# Altium project ESE516_TeamC&K_Project_.PrjPcb (part 2 of 2)

## Sheet sensor.SchDoc: Sensor
size 431 x 279 mm; Author: Changran Liu / Kaiwen Zhou; CompanyName: Upenn; DrawnBy: Changran Liu / Kaiwen Zhou; Engineer: Changran Liu / Kaiwen Zhou; Organization: Upenn; DocumentNumber: 9; SheetNumber: 8; SheetTotal: 9
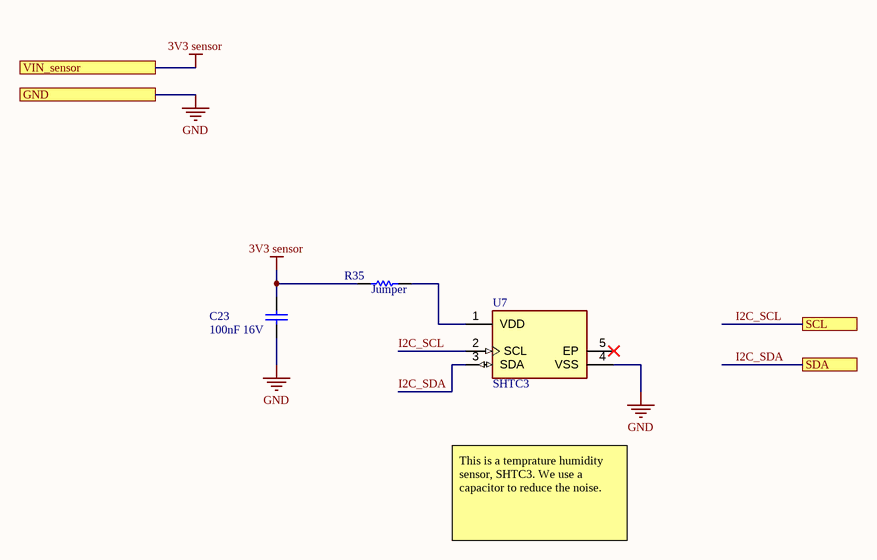
[diagram p7: sensor.SchDoc]

### Parts
C23  100nF 16V  [CAPC0603(1608)100_N]
R35  Jumper  [RESC0603(1608)_N]
U7  SHTC3  [FP-SHTC3-IPC_A]

### Ports
GND, SCL, SDA, VIN_sensor

### Nets
3V3 sensor: C23.2 R35.1 ; port VIN_sensor  [project net 3V3]
GND: C23.1 U7.4(VSS) ; port GND
I2C_SCL: U7.2(SCL) ; port SCL
I2C_SDA: U7.3(SDA) ; port SDA
NetR35_2: R35.2 U7.1(VDD)

Not connected (* = marked no-connect by the designer): U7 5(EP)*

### Notes on the sheet
- This is a temprature humidity sensor, SHTC3. We use a capacitor to reduce the noise.
- DWG. NO.
- REV.
- SHT.
- THIS DOCUMENT AND THE DATA DISCLOSED HEREIN OR HEREWITH IS THE PROPERTY OF ALTIUM LIMITED AND MAY BE FREELY DISTRIBUTED IN WHOLE. NO RIGHTS ARE RESERVED OR EXPRESS OR IMPLIED WARANTEE GIVEN.
- REVISION
- DESCRIPTION
- DATE
- APPROVED
- ENG:
- APPROVALS
- PROJECT
- DSN:
- CHK:
- REFERENCE DOCUMENTS
- PROJECT REVISION:
- TITLE
- DOCUMENT REVISION:
- DESIGN ITEM:
- BOM:
- FAB DWG:
- PCB DWG:
- ASSY DWG:
- SCALE:
- SIZE
- B
- CAGE CODE
- FILE NAME
- DWG NO.
- SHEET
- OF
- REV

### Library data of the parts
C23 = CMP-1035-02584-1: CAP 100nF 16V ±10% 0603 (1608 Metric) Thickness 1mm SMD; Tolerance: Â±10%; Case-EIA: 0603; Case-Metric: 1608; Technology: SMT; Max Thickness: 1 mm; Value: 100nF; Rated Voltage: 16 V
R35 = CMP-1012-00001-1: Jumper 0603 (1608 Metric); Case-Metric: 1608; Value: 0.00 Ohm; Power: None; Case-EIA: 0603; Technology: SMT; Tolerance: None
U7 = CMP-144040-000003-1: SENSOR HUMI/TEMP I2C 2% SMD; Manufacturer: Sensirion; Operating Supply Current: 0.3-900uA; Resolution: 16bits; Min Supply Voltage: 1.62V; Max Supply Voltage: 3.6V; Category: IC; Device Class L3: unset; ComponentLink2URL: https://www.sensirion.com/fileadmin/user_upload/customers/sensirion/Dokumente/0_Datasheets/Humidity/Sensirion_Humidity_Sensors_SHTC3_Datasheet.pdf; Ipc Land Pattern Name: DFN200X200X75-4; RoHS: TRUE; Height: 0.75mm; Interface: I2C; Temperature Range High: +125°C; Accuracy: 2%; Sensor Output: I2C; Automotive: No; Package: 0; Device Class L1: Sensors; Manufacturer Part Number: SHTC3; Digikey Description: SENSOR HUMI/TEMP I2C 2% SMD; Lead Free: Yes; Temperature: -40°C to +125°C; Device Class L2: Temperature and Humidity Sensors; ComponentLink2Description: Datasheet; Octopart: https://octopart.com/shtc3-sensirion-91912225; Mouser Description: SHTC3 Series 0 to 100% RH 3.6 V Humidity and Temperature Sensor IC - DFN-4; Temperature Range Low: -40°C

## Nets that join several sheets
3V3: MAIN (9 pins), MCU (7 pins), Memory (5 pins), Thumbstick (U6.3 U6.6), sensor (C23.2 R35.1)
5V: MAIN (J1.2 R6.1), Audio (C20.2 U5.6)
GND: MAIN (17 pins), FTDI (10 pins), MCU (22 pins), Memory (5 pins), 3.3V_BuckDesign (C16.1 C17.1 R27.1 U4.4), Audio (6 pins), Thumbstick (R32.1 R34.1 U6.1 U6.4), sensor (C23.1 U7.4)
VBUS: MAIN (J2.1), FTDI (C2.2 D2.4 FB1.1)
VIN: MAIN (R6.2), 3.3V_BuckDesign (R23.1)
VUSB: MAIN (TP1.1), FTDI (6 pins)
Audio V_~{SD}: MAIN (R38.2), MCU (U3.36), Audio (U5.1)
FLASH_MEM_SPI_SS: MCU (U3.37), Memory (R19.1 SD1.2 TP21.1)
I2C_SCL: MAIN (6 pins), MCU (U3.39), sensor (U7.2)
I2C_SDA: MAIN (6 pins), MCU (U3.38), sensor (U7.3)
JOYSTICK_X: MAIN (TP9.1), MCU (U3.27), Thumbstick (R31.1 R32.2)
JOYSTICK_Y: MAIN (TP10.1), MCU (U3.28), Thumbstick (R33.1 R34.2)
MCU_LED: MAIN (DS1.2), MCU (U3.16)
MCU_RX_UART_CLI: MAIN (TP4.1), FTDI (U1.7), MCU (U3.44)
MCU_TX_UART_CLI: MAIN (TP2.1), FTDI (U1.10), MCU (U3.43)
MEM_SPI_CLK: MAIN (R13.2), Memory (SD1.5 TP20.1)
MEM_SPI_MISO: MAIN (R12.2), Memory (SD1.7 TP19.1)
MEM_SPI_MOSI: MAIN (R11.2), Memory (SD1.3 TP18.1)
SERCOM1_PAD2_SPI_MISO: MAIN (R12.1), MCU (U3.8)
SERCOM1_PAD2_SPI_MOSI: MAIN (R11.1), MCU (U3.11)
SERCOM1_PAD3_SPI_SCK: MAIN (R13.1), MCU (U3.12)
SPEAKER_OUT: MAIN (TP8.1), MCU (U3.31), Audio (R30.1)
USB_DATA_N: MAIN (J2.2), FTDI (C5.2 D2.3 R1.1)
USB_DATA_P: MAIN (J2.3), FTDI (C6.2 D2.2 R2.1)
VOUT: MAIN (R7.1), 3.3V_BuckDesign (R24.2)

## Assembly variants
Build_Alt: not fitted FD1 FD2 FD3 TP1 TP2 TP3 TP4 TP5 TP6 TP7 TP8 TP9 TP10 TP11